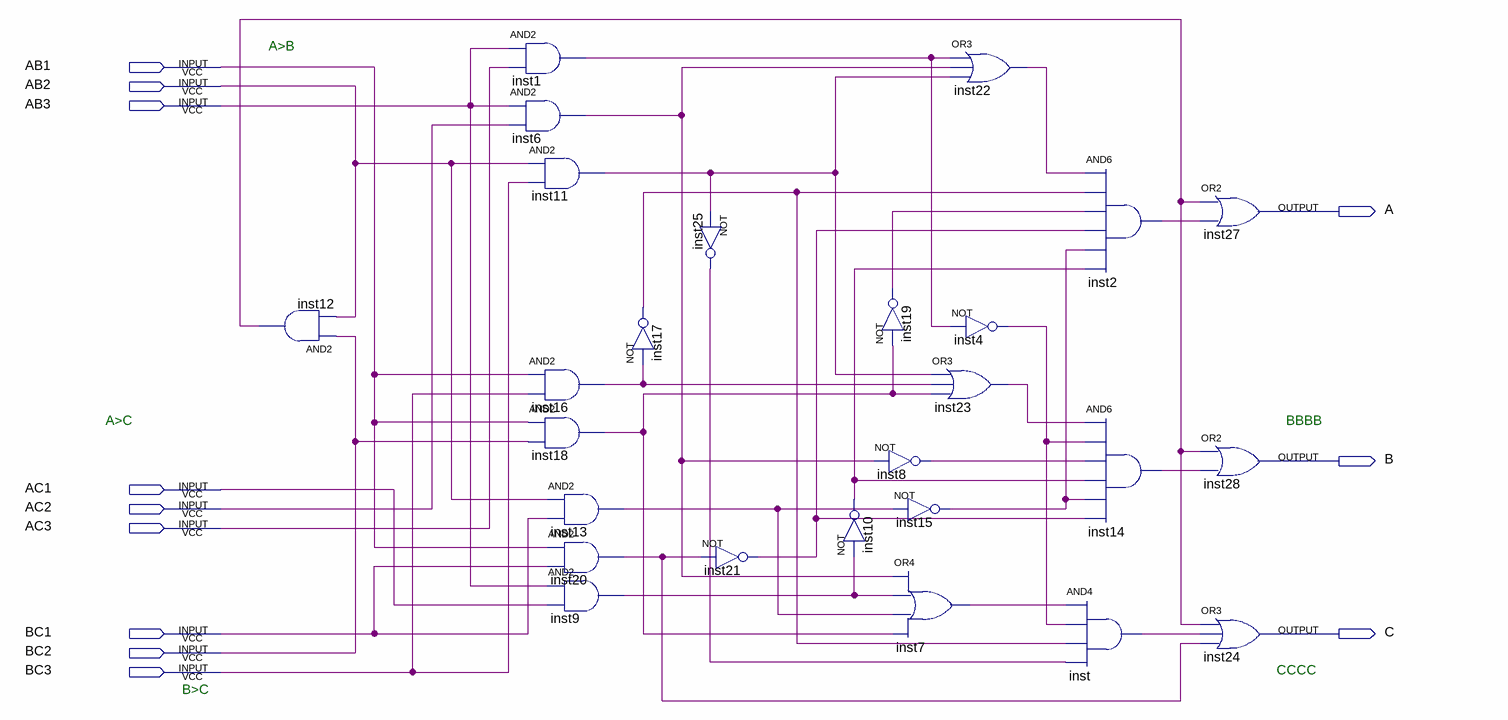
[diagram p0: schematic sheet]
// Quartus schematic Decoders.bdf as structural Verilog: 26 symbols, 12 pins
module Decoders (
  input  AB1,
  input  AB2,
  input  AB3,
  input  AC1,
  input  AC2,
  input  AC3,
  input  BC1,
  input  BC2,
  input  BC3,
  output A,
  output B,
  output C
);

  wire inst1_out, inst2_out, inst4_out, inst6_out, inst7_out, inst8_out, inst9_out, inst10_out, inst11_out,
       inst12_out, inst13_out, inst14_out, inst15_out, inst16_out, inst17_out, inst18_out, inst19_out,
       inst20_out, inst21_out, inst22_out, inst23_out, inst25_out, inst_out;

  and inst12 (inst12_out, BC2, AB2);
  and inst1 (inst1_out, AB3, AC3);
  and inst6 (inst6_out, AB3, AC2);
  and inst11 (inst11_out, AB2, BC3);
  and inst16 (inst16_out, AB1, BC3);
  and inst18 (inst18_out, AB1, BC2);
  and inst13 (inst13_out, AB2, BC1);
  and inst20 (inst20_out, AB1, BC1);
  and inst9 (inst9_out, AB3, AC1);
  not inst17 (inst17_out, inst16_out);
  not inst25 (inst25_out, inst11_out);
  not inst21 (inst21_out, inst20_out);
  not inst19 (inst19_out, inst18_out);
  not inst8 (inst8_out, inst6_out);
  not inst10 (inst10_out, inst9_out);
  or inst22 (inst22_out, inst1_out, inst6_out, inst11_out);
  not inst4 (inst4_out, inst1_out);
  or inst23 (inst23_out, inst11_out, inst16_out, inst18_out);
  not inst15 (inst15_out, inst13_out);
  or inst7 (inst7_out, inst6_out, inst9_out, inst13_out, inst18_out);
  and inst2 (inst2_out, inst22_out, inst17_out, inst19_out, inst21_out, inst15_out, inst10_out);
  and inst14 (inst14_out, inst23_out, inst4_out, inst8_out, inst10_out, inst15_out, inst21_out);
  and inst (inst_out, inst7_out, inst4_out, inst17_out, inst25_out);
  or inst27 (A, inst12_out, inst2_out);
  or inst28 (B, inst12_out, inst14_out);
  or inst24 (C, inst12_out, inst_out, inst20_out);

  // Notes on the sheet:
  //   A>B
  //   A>C
  //   BBBB
  //   CCCC
  //   B>C
endmodule
